# Altium project Flexprint_Serverport.PrjPcb
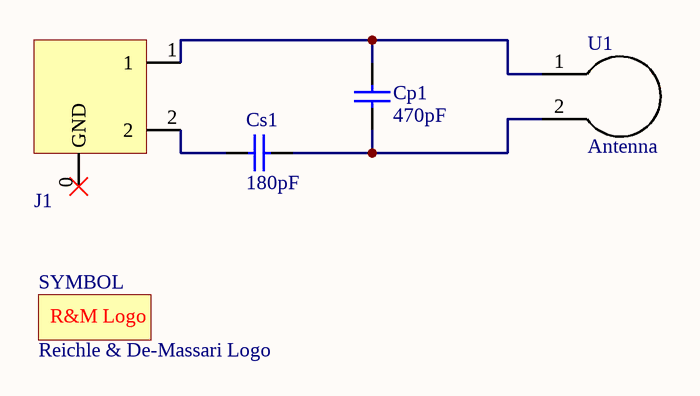
[diagram p0: Flexprint_Serverport.SchDoc]
1 sheet, 5 parts. Net scope: global (net labels, ports and power ports of the same name join across sheets).
Board file: Flexprint_Serverport.PcbDoc

## Sheet Flexprint_Serverport.SchDoc: Flexprint Serverport
size A3; Author: AH; CompanyName: Reichle & De-Massari; Organization: Reichle & De-Massari; Address1: Binzstrasse 32; Address2: 8620 Wetzikon; Address3: Switzerland; DocumentNumber: STU_012858; Revision: 0.1; SheetNumber: 1; SheetTotal: 1

### Parts
Cp1  470pF  [C0402]
Cs1  180pF  [C0402]
J1  Molex 0781710002  [CONN_2x1]  (value not drawn)
SYMBOL  Reichle & De-Massari Logo  [SYMBOL_R&M]  (net tie)
U1  Antenna  [Ant]  (net tie)

### Nets
NetCp1_1: Cp1.1 Cs1.1 U1.2
NetCp1_2: Cp1.2 J1.1 U1.1
NetCs1_2: Cs1.2 J1.2

Not connected (* = marked no-connect by the designer): J1 0(GND)*

### Notes on the sheet
- Title
- Size:
- Date:
- A3
- Number:
- Time:
- Revision:
- Sheet
- of
- File:
- (in symbol SYMBOL_R&M) R&M Logo

### Library data of the parts
Cp1 = Cap_470pF_0402: 470pF ±1% 50V Ceramic Capacitor C0G, NP0 0402 (1005 Metric); Manufacturer PartNr: GRM1555C1H471FA01D; Manufacturer: Murata; Replaceable: yes; Dielectric Grade: C0G; tolerance: ±1%; voltage: 50V; Supplier 1: Digi-Key; Supplier Part Number 1: 490-8207-1-ND; Footprint/Package: 0402; value: 470pF
Cs1 = Cap_180pF_0402: 180pF ±1% 50V Ceramic Capacitor C0G, NP0 0402 (1005 Metric); Manufacturer: Murata; Manufacturer PartNr: GRM1555C1H181FA01D; Replaceable: yes; Supplier Part Number 1: 490-8187-1-ND; Dielectric Grade: C0G; tolerance: ±1%; voltage: 50V; Footprint/Package: 0402; Supplier 1: Digi-Key; value: 180pF
J1 = Conn_2x1: Molex, connector Header SMD, 2 position 0.047" (1.20mm); Replaceable: no; Manufacturer: Molex; value: Molex 0781710002; Supplier 1: Digy-Key; Supplier Part Number 1: WM4459CT-ND; Footprint/Package: SMD; Manufacturer PartNr: 0781710002
SYMBOL = SYMBOL_R&M: Replaceable: no; value: Overlay; Footprint/Package: 2.54mm
U1 = Antenna: value: Antenna